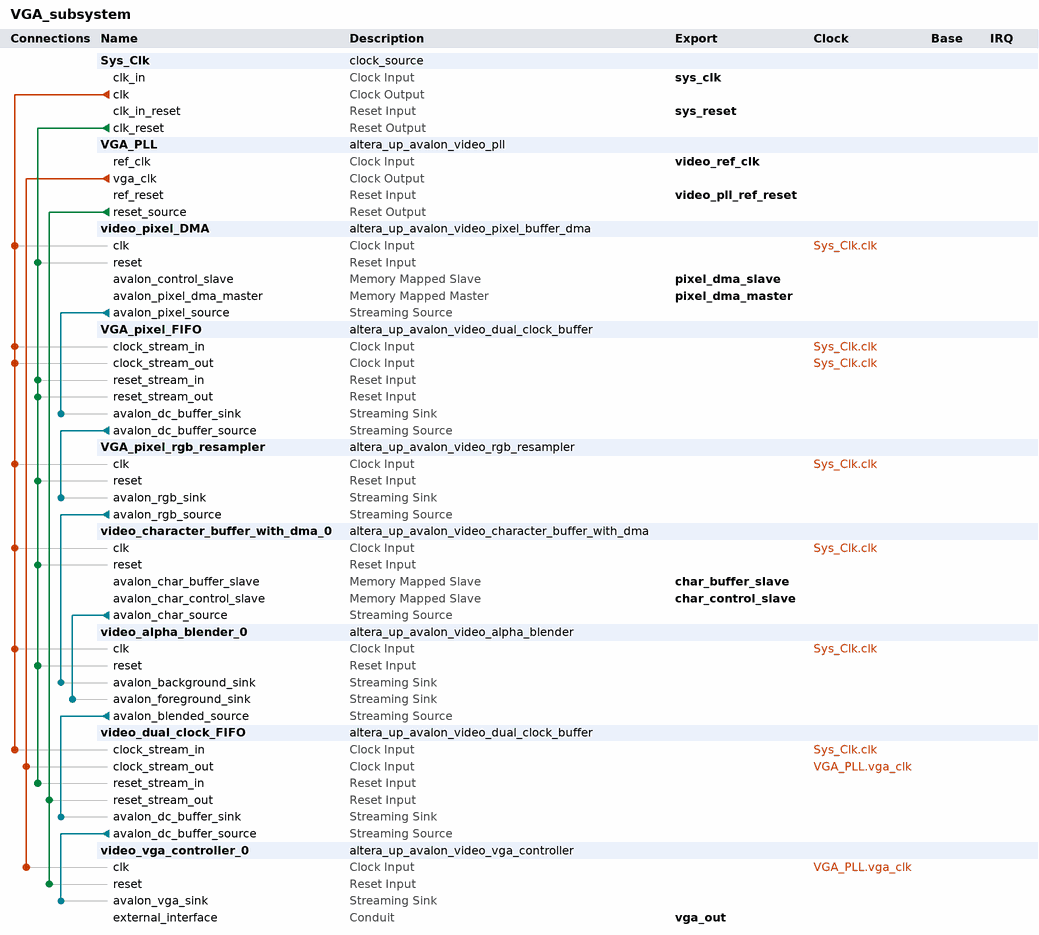
[diagram p0: system contents]
# Platform Designer (Qsys) system VGA_subsystem, Cyclone V 5CSEMA5F31C6
# Parameters at their usual value, and those the tool derives, are not listed.
package require -exact qsys 16.1
create_system VGA_subsystem
set_project_property DEVICE_FAMILY {Cyclone V}
set_project_property DEVICE 5CSEMA5F31C6

add_instance Sys_Clk clock_source 16.1
set_instance_parameter_value Sys_Clk clockFrequency 50000000
set_instance_parameter_value Sys_Clk clockFrequencyKnown false

add_instance VGA_PLL altera_up_avalon_video_pll 16.1
set_instance_parameter_value VGA_PLL camera {5MP Digital Camera}
set_instance_parameter_value VGA_PLL gui_refclk 50.0
set_instance_parameter_value VGA_PLL lcd {7" LCD on VEEK-MT and MTL Module}

add_instance video_pixel_DMA altera_up_avalon_video_pixel_buffer_dma 16.1
set_instance_parameter_value video_pixel_DMA addr_mode Consecutive
set_instance_parameter_value video_pixel_DMA back_start_address 0
set_instance_parameter_value video_pixel_DMA color_space {16-bit RGB}
set_instance_parameter_value video_pixel_DMA image_height 480
set_instance_parameter_value video_pixel_DMA image_width 640
set_instance_parameter_value video_pixel_DMA start_address 0

add_instance VGA_pixel_FIFO altera_up_avalon_video_dual_clock_buffer 16.1
set_instance_parameter_value VGA_pixel_FIFO color_bits 16
set_instance_parameter_value VGA_pixel_FIFO color_planes 1

add_instance VGA_pixel_rgb_resampler altera_up_avalon_video_rgb_resampler 16.1
set_instance_parameter_value VGA_pixel_rgb_resampler alpha 1023
set_instance_parameter_value VGA_pixel_rgb_resampler input_type {16-bit RGB}
set_instance_parameter_value VGA_pixel_rgb_resampler output_type {30-bit RGB}

add_instance video_character_buffer_with_dma_0 altera_up_avalon_video_character_buffer_with_dma 16.1
set_instance_parameter_value video_character_buffer_with_dma_0 enable_transparency true

add_instance video_alpha_blender_0 altera_up_avalon_video_alpha_blender 16.1
set_instance_parameter_value video_alpha_blender_0 mode Normal

add_instance video_dual_clock_FIFO altera_up_avalon_video_dual_clock_buffer 16.1
set_instance_parameter_value video_dual_clock_FIFO color_bits 10

add_instance video_vga_controller_0 altera_up_avalon_video_vga_controller 16.1
set_instance_parameter_value video_vga_controller_0 board DE1-SoC
set_instance_parameter_value video_vga_controller_0 resolution {VGA 640x480}

# connections
add_connection Sys_Clk.clk VGA_pixel_FIFO.clock_stream_in clock
add_connection Sys_Clk.clk VGA_pixel_FIFO.clock_stream_out clock
add_connection Sys_Clk.clk VGA_pixel_rgb_resampler.clk clock
add_connection Sys_Clk.clk video_alpha_blender_0.clk clock
add_connection Sys_Clk.clk video_character_buffer_with_dma_0.clk clock
add_connection Sys_Clk.clk video_dual_clock_FIFO.clock_stream_in clock
add_connection Sys_Clk.clk video_pixel_DMA.clk clock
add_connection VGA_PLL.vga_clk video_dual_clock_FIFO.clock_stream_out clock
add_connection VGA_PLL.vga_clk video_vga_controller_0.clk clock
add_connection Sys_Clk.clk_reset VGA_pixel_FIFO.reset_stream_in reset
add_connection Sys_Clk.clk_reset VGA_pixel_FIFO.reset_stream_out reset
add_connection Sys_Clk.clk_reset VGA_pixel_rgb_resampler.reset reset
add_connection Sys_Clk.clk_reset video_alpha_blender_0.reset reset
add_connection Sys_Clk.clk_reset video_character_buffer_with_dma_0.reset reset
add_connection Sys_Clk.clk_reset video_dual_clock_FIFO.reset_stream_in reset
add_connection Sys_Clk.clk_reset video_pixel_DMA.reset reset
add_connection VGA_PLL.reset_source video_dual_clock_FIFO.reset_stream_out reset
add_connection VGA_PLL.reset_source video_vga_controller_0.reset reset
add_connection VGA_pixel_FIFO.avalon_dc_buffer_source VGA_pixel_rgb_resampler.avalon_rgb_sink avalon_streaming
add_connection VGA_pixel_rgb_resampler.avalon_rgb_source video_alpha_blender_0.avalon_background_sink avalon_streaming
add_connection video_alpha_blender_0.avalon_blended_source video_dual_clock_FIFO.avalon_dc_buffer_sink avalon_streaming
add_connection video_character_buffer_with_dma_0.avalon_char_source video_alpha_blender_0.avalon_foreground_sink avalon_streaming
add_connection video_dual_clock_FIFO.avalon_dc_buffer_source video_vga_controller_0.avalon_vga_sink avalon_streaming
add_connection video_pixel_DMA.avalon_pixel_source VGA_pixel_FIFO.avalon_dc_buffer_sink avalon_streaming

# exported interfaces
add_interface char_buffer_slave avalon slave
set_interface_property char_buffer_slave EXPORT_OF video_character_buffer_with_dma_0.avalon_char_buffer_slave
add_interface char_control_slave avalon slave
set_interface_property char_control_slave EXPORT_OF video_character_buffer_with_dma_0.avalon_char_control_slave
add_interface pixel_dma_master avalon master
set_interface_property pixel_dma_master EXPORT_OF video_pixel_DMA.avalon_pixel_dma_master
add_interface pixel_dma_slave avalon slave
set_interface_property pixel_dma_slave EXPORT_OF video_pixel_DMA.avalon_control_slave
add_interface sys_clk clock sink
set_interface_property sys_clk EXPORT_OF Sys_Clk.clk_in
add_interface sys_reset reset sink
set_interface_property sys_reset EXPORT_OF Sys_Clk.clk_in_reset
add_interface vga_out conduit end
set_interface_property vga_out EXPORT_OF video_vga_controller_0.external_interface
add_interface video_pll_ref_reset reset sink
set_interface_property video_pll_ref_reset EXPORT_OF VGA_PLL.ref_reset
add_interface video_ref_clk clock sink
set_interface_property video_ref_clk EXPORT_OF VGA_PLL.ref_clk

set_interconnect_requirement {$system} qsys_mm.clockCrossingAdapter HANDSHAKE
set_interconnect_requirement {$system} qsys_mm.enableEccProtection FALSE
set_interconnect_requirement {$system} qsys_mm.insertDefaultSlave FALSE
set_interconnect_requirement {$system} qsys_mm.maxAdditionalLatency 1

save_system VGA_subsystem.qsys
